# Altium schematic sheet pay-ssm.SchDoc
size A3; DrawnBy: Lorna Lan; DocumentNumber: 1; Revision: v4.2; SheetNumber: 1; SheetTotal: 16
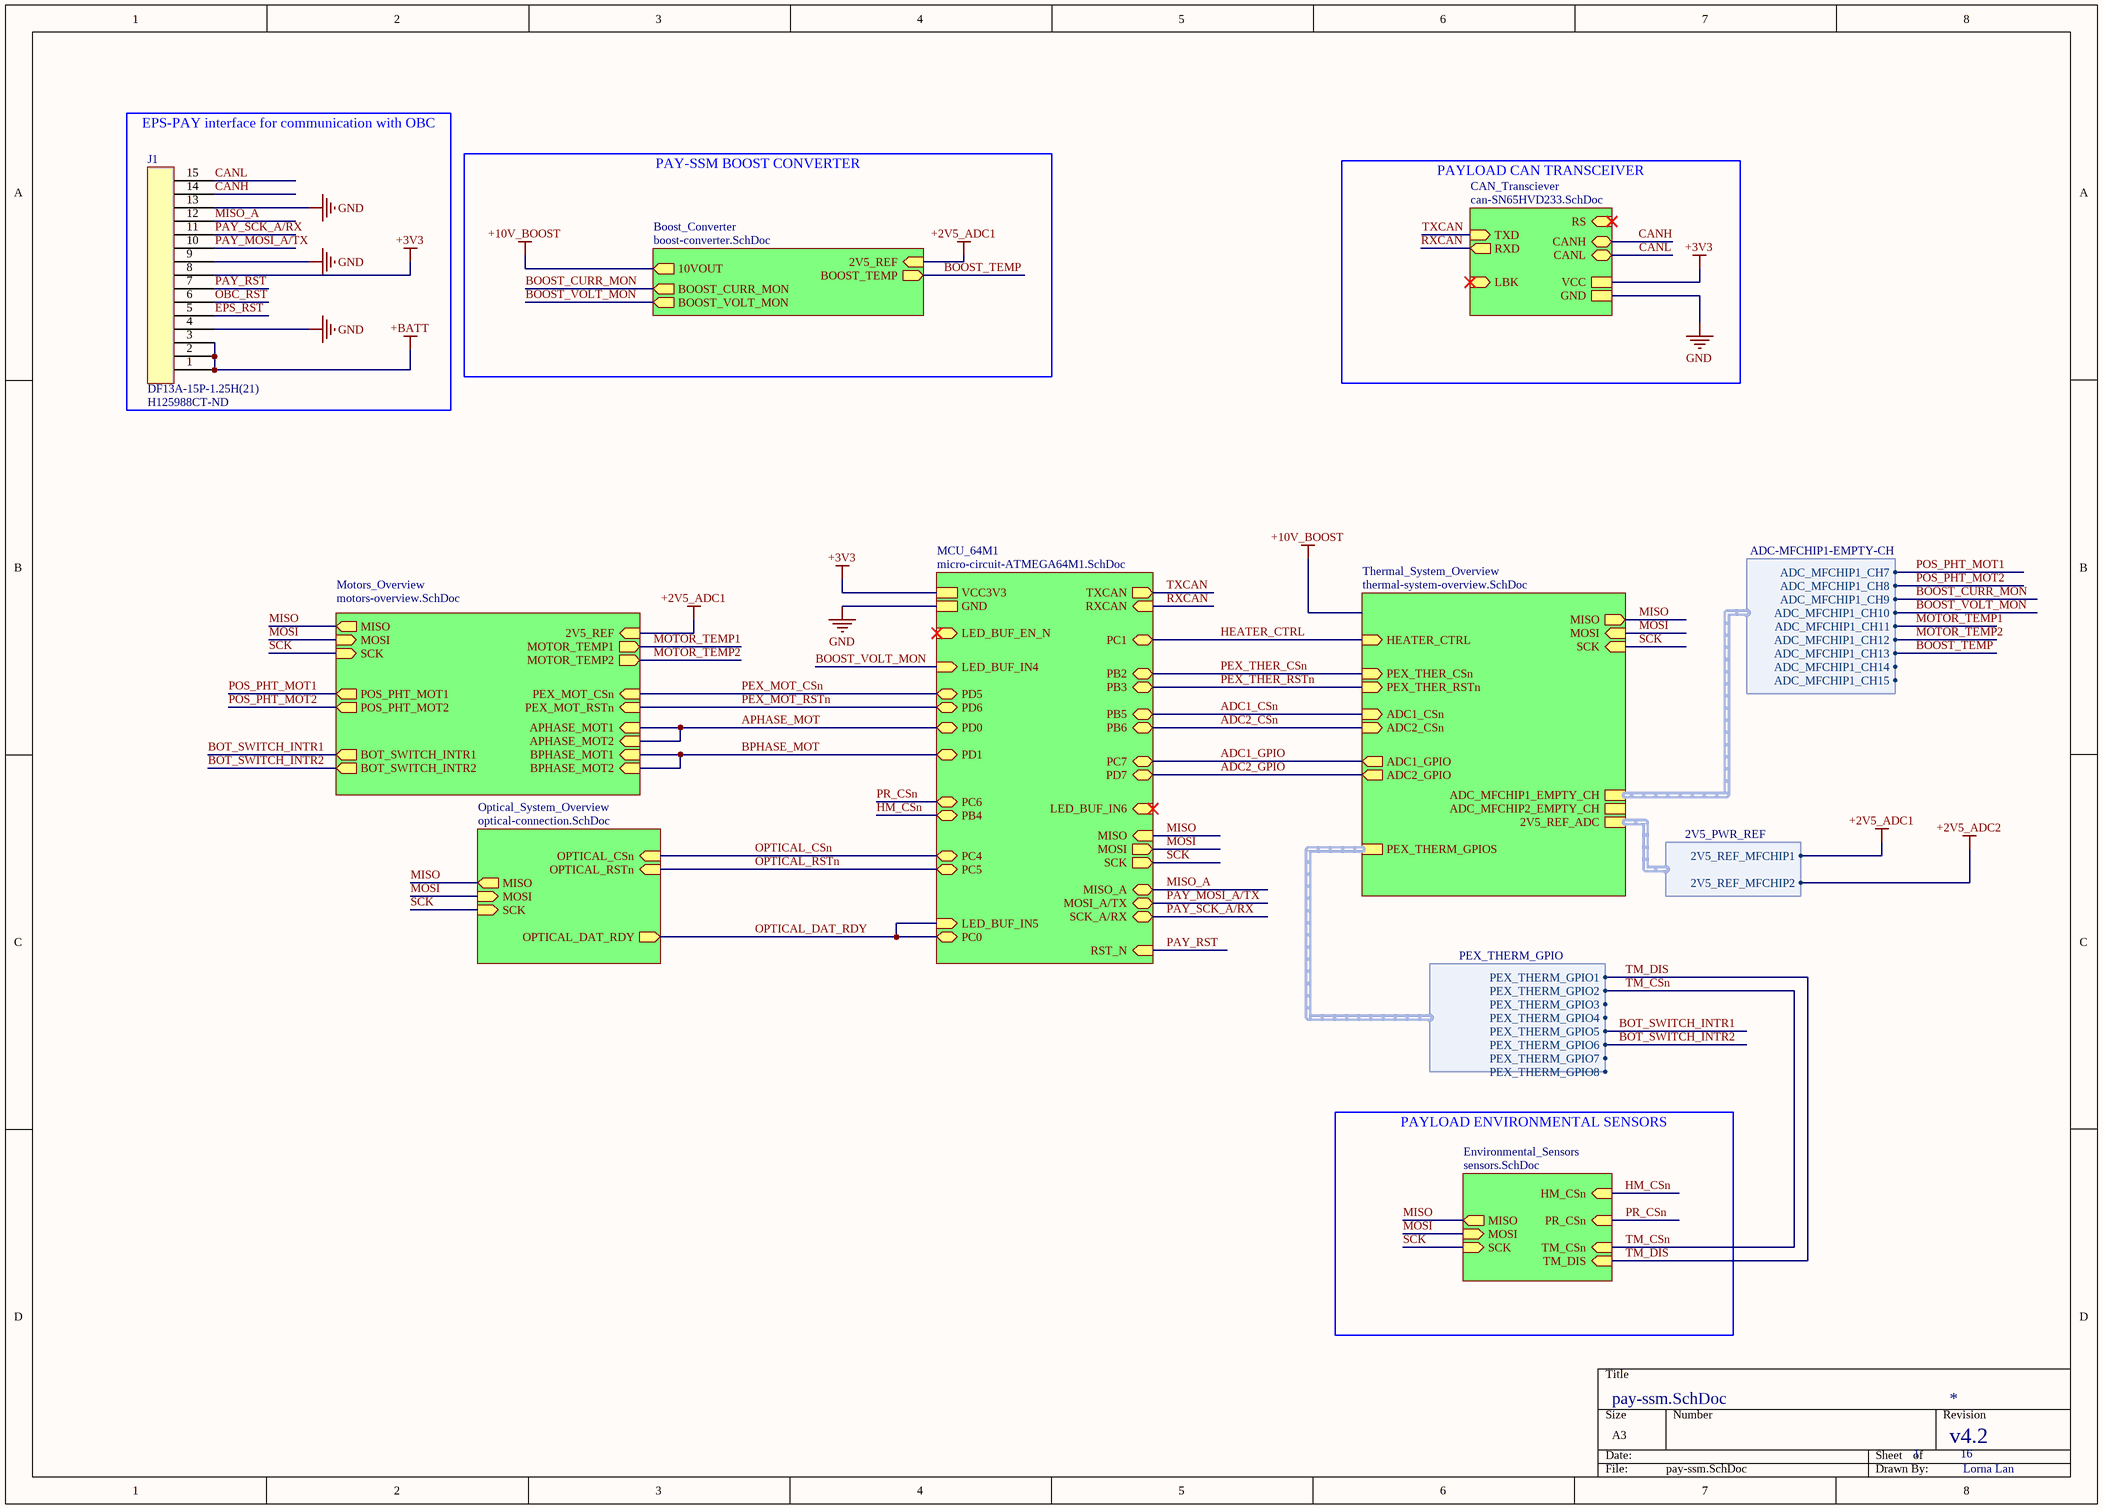
[diagram p0: pay-ssm.SchDoc]

## Parts
J1  DF13A-15P-1.25H(21)  Supplier Part Number 1: H125988CT-ND  [DF13A-15P-1.25H(21)]

## Sub-sheets
Boost_Converter = boost-converter.SchDoc: 10VOUT (out), BOOST_CURR_MON (out), BOOST_VOLT_MON (out), 2V5_REF (in), BOOST_TEMP (out)
CAN_Transciever = can-SN65HVD233.SchDoc: RS (in), GND, VCC, CANH (bidir), CANL (bidir), LBK (in), TXD (in), RXD (out)
Environmental_Sensors = sensors.SchDoc: SCK (in), MOSI (in), MISO (out), PR_CSn (in), TM_CSn (in), HM_CSn (in), TM_DIS (in)
MCU_64M1 = micro-circuit-ATMEGA64M1.SchDoc: GND, PD7 (bidir), PD6 (bidir), PD5 (bidir), PD1 (bidir), PD0 (bidir), PC7 (bidir), PC6 (bidir), PC1 (bidir), PC5 (bidir), PC4 (bidir), PB6 (bidir), PB5 (bidir), PB2 (bidir), PB3 (bidir), PB4 (bidir), PC0 (bidir), TXCAN (out), RXCAN (in), SCK (out), MOSI (out), LED_BUF_IN6 (in), MOSI_A/TX (bidir), LED_BUF_IN4 (in), LED_BUF_IN5 (in), SCK_A/RX (bidir), MISO (in), MISO_A (bidir), RST_N (in), LED_BUF_EN_N (in), VCC3V3
Motors_Overview = motors-overview.SchDoc: SCK (in), MOSI (in), MISO (out), PEX_MOT_CSn (in), PEX_MOT_RSTn (in), BOT_SWITCH_INTR1 (out), APHASE_MOT1 (in), BOT_SWITCH_INTR2 (out), APHASE_MOT2 (in), POS_PHT_MOT2 (out), POS_PHT_MOT1 (out), BPHASE_MOT2 (in), BPHASE_MOT1 (in), 2V5_REF (in), MOTOR_TEMP1 (out), MOTOR_TEMP2 (out)
Optical_System_Overview = optical-connection.SchDoc: SCK (in), OPTICAL_CSn (in), OPTICAL_RSTn (in), MISO (out), MOSI (in), OPTICAL_DAT_RDY (out)
Thermal_System_Overview = thermal-system-overview.SchDoc: MOSI (in), SCK (in), HEATER_CTRL (in), ADC_MFCHIP2_EMPTY_CH (harness ADC-MFCHIP2-EMPTY-CH), MISO (out), ADC_MFCHIP1_EMPTY_CH (harness ADC-MFCHIP1-EMPTY-CH), PEX_THERM_GPIOS (harness PEX_THERM_GPIO), ADC2_CSn (in), ADC1_CSn (in), PEX_THER_CSn (in), 2V5_REF_ADC (harness 2V5_PWR_REF), PEX_THER_RSTn (in), ADC2_GPIO (out), ADC1_GPIO (out)

## Harnesses
ADC-MFCHIP1-EMPTY-CH: ADC_MFCHIP1_CH7, ADC_MFCHIP1_CH8, ADC_MFCHIP1_CH9, ADC_MFCHIP1_CH10, ADC_MFCHIP1_CH11, ADC_MFCHIP1_CH12, ADC_MFCHIP1_CH13, ADC_MFCHIP1_CH14, ADC_MFCHIP1_CH15
PEX_THERM_GPIO: PEX_THERM_GPIO1, PEX_THERM_GPIO2, PEX_THERM_GPIO3, PEX_THERM_GPIO4, PEX_THERM_GPIO5, PEX_THERM_GPIO6, PEX_THERM_GPIO7, PEX_THERM_GPIO8
2V5_PWR_REF: 2V5_REF_MFCHIP1, 2V5_REF_MFCHIP2

## Nets
+2V5_ADC1: sheet Boost_Converter/2V5_REF, sheet Motors_Overview/2V5_REF, sheet Thermal_System_Overview/2V5_REF_ADC.2V5_REF_MFCHIP1
+2V5_ADC2: sheet Thermal_System_Overview/2V5_REF_ADC.2V5_REF_MFCHIP2
+3V3: J1.8 ; sheet CAN_Transciever/VCC, sheet MCU_64M1/VCC3V3
+10V_BOOST: sheet Boost_Converter/10VOUT
+BATT: J1.1 J1.2 J1.3
GND: J1.4 J1.9 J1.13 ; sheet CAN_Transciever/GND, sheet MCU_64M1/GND
ADC1_CSn: sheet MCU_64M1/PB5, sheet Thermal_System_Overview/ADC1_CSn
ADC1_GPIO: sheet MCU_64M1/PC7, sheet Thermal_System_Overview/ADC1_GPIO
ADC2_CSn: sheet MCU_64M1/PB6, sheet Thermal_System_Overview/ADC2_CSn
ADC2_GPIO: sheet MCU_64M1/PD7, sheet Thermal_System_Overview/ADC2_GPIO
APHASE_MOT: sheet MCU_64M1/PD0, sheet Motors_Overview/APHASE_MOT1, sheet Motors_Overview/APHASE_MOT2
BOOST_CURR_MON: sheet Boost_Converter/BOOST_CURR_MON, sheet Thermal_System_Overview/ADC_MFCHIP1_EMPTY_CH.ADC_MFCHIP1_CH9
BOOST_TEMP: sheet Boost_Converter/BOOST_TEMP, sheet Thermal_System_Overview/ADC_MFCHIP1_EMPTY_CH.ADC_MFCHIP1_CH13
BOOST_VOLT_MON: sheet MCU_64M1/LED_BUF_IN4, sheet Boost_Converter/BOOST_VOLT_MON, sheet Thermal_System_Overview/ADC_MFCHIP1_EMPTY_CH.ADC_MFCHIP1_CH10
BOT_SWITCH_INTR1: sheet Motors_Overview/BOT_SWITCH_INTR1, sheet Thermal_System_Overview/PEX_THERM_GPIOS.PEX_THERM_GPIO5
BOT_SWITCH_INTR2: sheet Motors_Overview/BOT_SWITCH_INTR2, sheet Thermal_System_Overview/PEX_THERM_GPIOS.PEX_THERM_GPIO6
BPHASE_MOT: sheet MCU_64M1/PD1, sheet Motors_Overview/BPHASE_MOT2, sheet Motors_Overview/BPHASE_MOT1
CANH: J1.14 ; sheet CAN_Transciever/CANH
CANL: J1.15 ; sheet CAN_Transciever/CANL
EPS_RST: J1.5
HEATER_CTRL: sheet MCU_64M1/PC1, sheet Thermal_System_Overview/HEATER_CTRL
HM_CSn: sheet Environmental_Sensors/HM_CSn, sheet MCU_64M1/PB4
MISO: sheet Environmental_Sensors/MISO, sheet MCU_64M1/MISO, sheet Motors_Overview/MISO, sheet Thermal_System_Overview/MISO, sheet Optical_System_Overview/MISO
MISO_A: J1.12 ; sheet MCU_64M1/MISO_A
MOSI: sheet Environmental_Sensors/MOSI, sheet MCU_64M1/MOSI, sheet Motors_Overview/MOSI, sheet Thermal_System_Overview/MOSI, sheet Optical_System_Overview/MOSI
MOTOR_TEMP1: sheet Motors_Overview/MOTOR_TEMP1, sheet Thermal_System_Overview/ADC_MFCHIP1_EMPTY_CH.ADC_MFCHIP1_CH11
MOTOR_TEMP2: sheet Motors_Overview/MOTOR_TEMP2, sheet Thermal_System_Overview/ADC_MFCHIP1_EMPTY_CH.ADC_MFCHIP1_CH12
OBC_RST: J1.6
OPTICAL_CSn: sheet MCU_64M1/PC4, sheet Optical_System_Overview/OPTICAL_CSn
OPTICAL_DAT_RDY: sheet MCU_64M1/PC0, sheet MCU_64M1/LED_BUF_IN5, sheet Optical_System_Overview/OPTICAL_DAT_RDY
OPTICAL_RSTn: sheet MCU_64M1/PC5, sheet Optical_System_Overview/OPTICAL_RSTn
PAY_MOSI_A/TX: J1.10 ; sheet MCU_64M1/MOSI_A/TX
PAY_RST: J1.7 ; sheet MCU_64M1/RST_N
PAY_SCK_A/RX: J1.11 ; sheet MCU_64M1/SCK_A/RX
PEX_MOT_CSn: sheet MCU_64M1/PD5, sheet Motors_Overview/PEX_MOT_CSn
PEX_MOT_RSTn: sheet MCU_64M1/PD6, sheet Motors_Overview/PEX_MOT_RSTn
PEX_THER_CSn: sheet MCU_64M1/PB2, sheet Thermal_System_Overview/PEX_THER_CSn
PEX_THER_RSTn: sheet MCU_64M1/PB3, sheet Thermal_System_Overview/PEX_THER_RSTn
POS_PHT_MOT1: sheet Motors_Overview/POS_PHT_MOT1, sheet Thermal_System_Overview/ADC_MFCHIP1_EMPTY_CH.ADC_MFCHIP1_CH7
POS_PHT_MOT2: sheet Motors_Overview/POS_PHT_MOT2, sheet Thermal_System_Overview/ADC_MFCHIP1_EMPTY_CH.ADC_MFCHIP1_CH8
PR_CSn: sheet Environmental_Sensors/PR_CSn, sheet MCU_64M1/PC6
RXCAN: sheet CAN_Transciever/RXD, sheet MCU_64M1/RXCAN
SCK: sheet Environmental_Sensors/SCK, sheet MCU_64M1/SCK, sheet Motors_Overview/SCK, sheet Thermal_System_Overview/SCK, sheet Optical_System_Overview/SCK
TM_CSn: sheet Environmental_Sensors/TM_CSn, sheet Thermal_System_Overview/PEX_THERM_GPIOS.PEX_THERM_GPIO2
TM_DIS: sheet Environmental_Sensors/TM_DIS, sheet Thermal_System_Overview/PEX_THERM_GPIOS.PEX_THERM_GPIO1
TXCAN: sheet CAN_Transciever/TXD, sheet MCU_64M1/TXCAN

## Notes on the sheet
- PAY-SSM BOOST CONVERTER
- PAYLOAD CAN TRANSCEIVER
- (near J1) EPS-PAY interface for communication with OBC
- PAYLOAD ENVIRONMENTAL SENSORS

## Library data of the parts
J1 = DF13A-15P-1.25H(21): 15 pos DF13 right angle surface mount connector; Supplier 1: Digi-Key